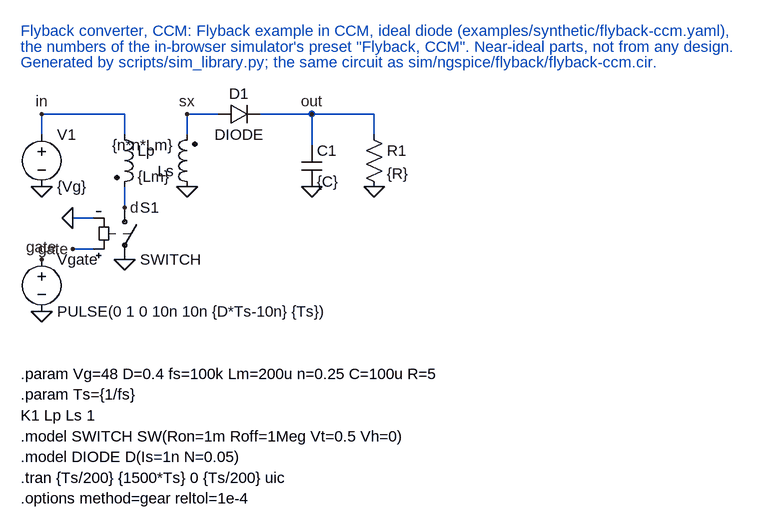
[diagram p0: schematic flyback-ccm.asc]
flyback-ccm.asc, the LTspice schematic file:
Version 4
SHEET 1 672 880
WIRE 0 64 0 96
WIRE 0 64 128 64
WIRE 128 64 128 96
WIRE 80 272 48 272
WIRE 80 224 48 224
WIRE 128 176 128 208
WIRE 224 96 224 64
WIRE 224 64 272 64
WIRE 336 64 416 64
WIRE 416 64 416 112
WIRE 416 64 512 64
WIRE 512 64 512 96
FLAG 0 64 in
FLAG 0 176 0
FLAG 0 288 gate
FLAG 0 368 0
FLAG 48 272 gate
FLAG 48 224 0
FLAG 128 208 d
FLAG 128 288 0
FLAG 224 176 0
FLAG 224 64 sx
FLAG 416 176 0
FLAG 512 176 0
FLAG 416 64 out
SYMBOL voltage 0 80 R0
SYMATTR InstName V1
SYMATTR Value {Vg}
SYMBOL voltage 0 272 R0
SYMATTR InstName Vgate
SYMATTR Value PULSE(0 1 0 10n 10n {D*Ts-10n} {Ts})
SYMBOL ind2 112 80 R0
SYMATTR InstName Lp
SYMATTR Value {Lm}
SYMBOL sw 128 192 R0
SYMATTR InstName S1
SYMATTR Value SWITCH
SYMBOL ind2 240 192 R180
SYMATTR InstName Ls
SYMATTR Value {n*n*Lm}
SYMBOL diode 272 80 R270
WINDOW 0 32 32 VTop 2
WINDOW 3 0 32 VBottom 2
SYMATTR InstName D1
SYMATTR Value DIODE
SYMBOL cap 400 112 R0
SYMATTR InstName C1
SYMATTR Value {C}
SYMBOL res 496 80 R0
SYMATTR InstName R1
SYMATTR Value {R}
TEXT -32 -64 Left 2 ;Flyback converter, CCM: Flyback example in CCM, ideal diode (examples/synthetic/flyback-ccm.yaml),
TEXT -32 -40 Left 2 ;the numbers of the in-browser simulator's preset "Flyback, CCM". Near-ideal parts, not from any design.
TEXT -32 -16 Left 2 ;Generated by scripts/sim_library.py; the same circuit as sim/ngspice/flyback/flyback-ccm.cir.
TEXT -32 464 Left 2 !.param Vg=48 D=0.4 fs=100k Lm=200u n=0.25 C=100u R=5
TEXT -32 496 Left 2 !.param Ts={1/fs}
TEXT -32 528 Left 2 !K1 Lp Ls 1
TEXT -32 560 Left 2 !.model SWITCH SW(Ron=1m Roff=1Meg Vt=0.5 Vh=0)
TEXT -32 592 Left 2 !.model DIODE D(Is=1n N=0.05)
TEXT -32 624 Left 2 !.tran {Ts/200} {1500*Ts} 0 {Ts/200} uic
TEXT -32 656 Left 2 !.options method=gear reltol=1e-4

The netlist it stands for:
* flyback-ccm.asc
V1 in 0 {Vg}
Vgate gate 0 PULSE(0 1 0 10n 10n {D*Ts-10n} {Ts})
Lp in d {Lm}
S1 d 0 gate 0 SWITCH
Ls 0 sx {n*n*Lm}
D1 sx out DIODE
C1 out 0 {C}
R1 out 0 {R}
.model D D
.lib standard.dio
* Flyback converter, CCM: Flyback example in CCM, ideal diode (examples/synthetic/flyback-ccm.yaml),
* the numbers of the in-browser simulator's preset "Flyback, CCM". Near-ideal parts, not from any design.
* Generated by scripts/sim_library.py; the same circuit as sim/ngspice/flyback/flyback-ccm.cir.
.param Vg=48 D=0.4 fs=100k Lm=200u n=0.25 C=100u R=5
.param Ts={1/fs}
K1 Lp Ls 1
.model SWITCH SW(Ron=1m Roff=1Meg Vt=0.5 Vh=0)
.model DIODE D(Is=1n N=0.05)
.tran {Ts/200} {1500*Ts} 0 {Ts/200} uic
.options method=gear reltol=1e-4
.backanno
.end